# EAGLE design hoekdrive23 (EAGLE 5.12)
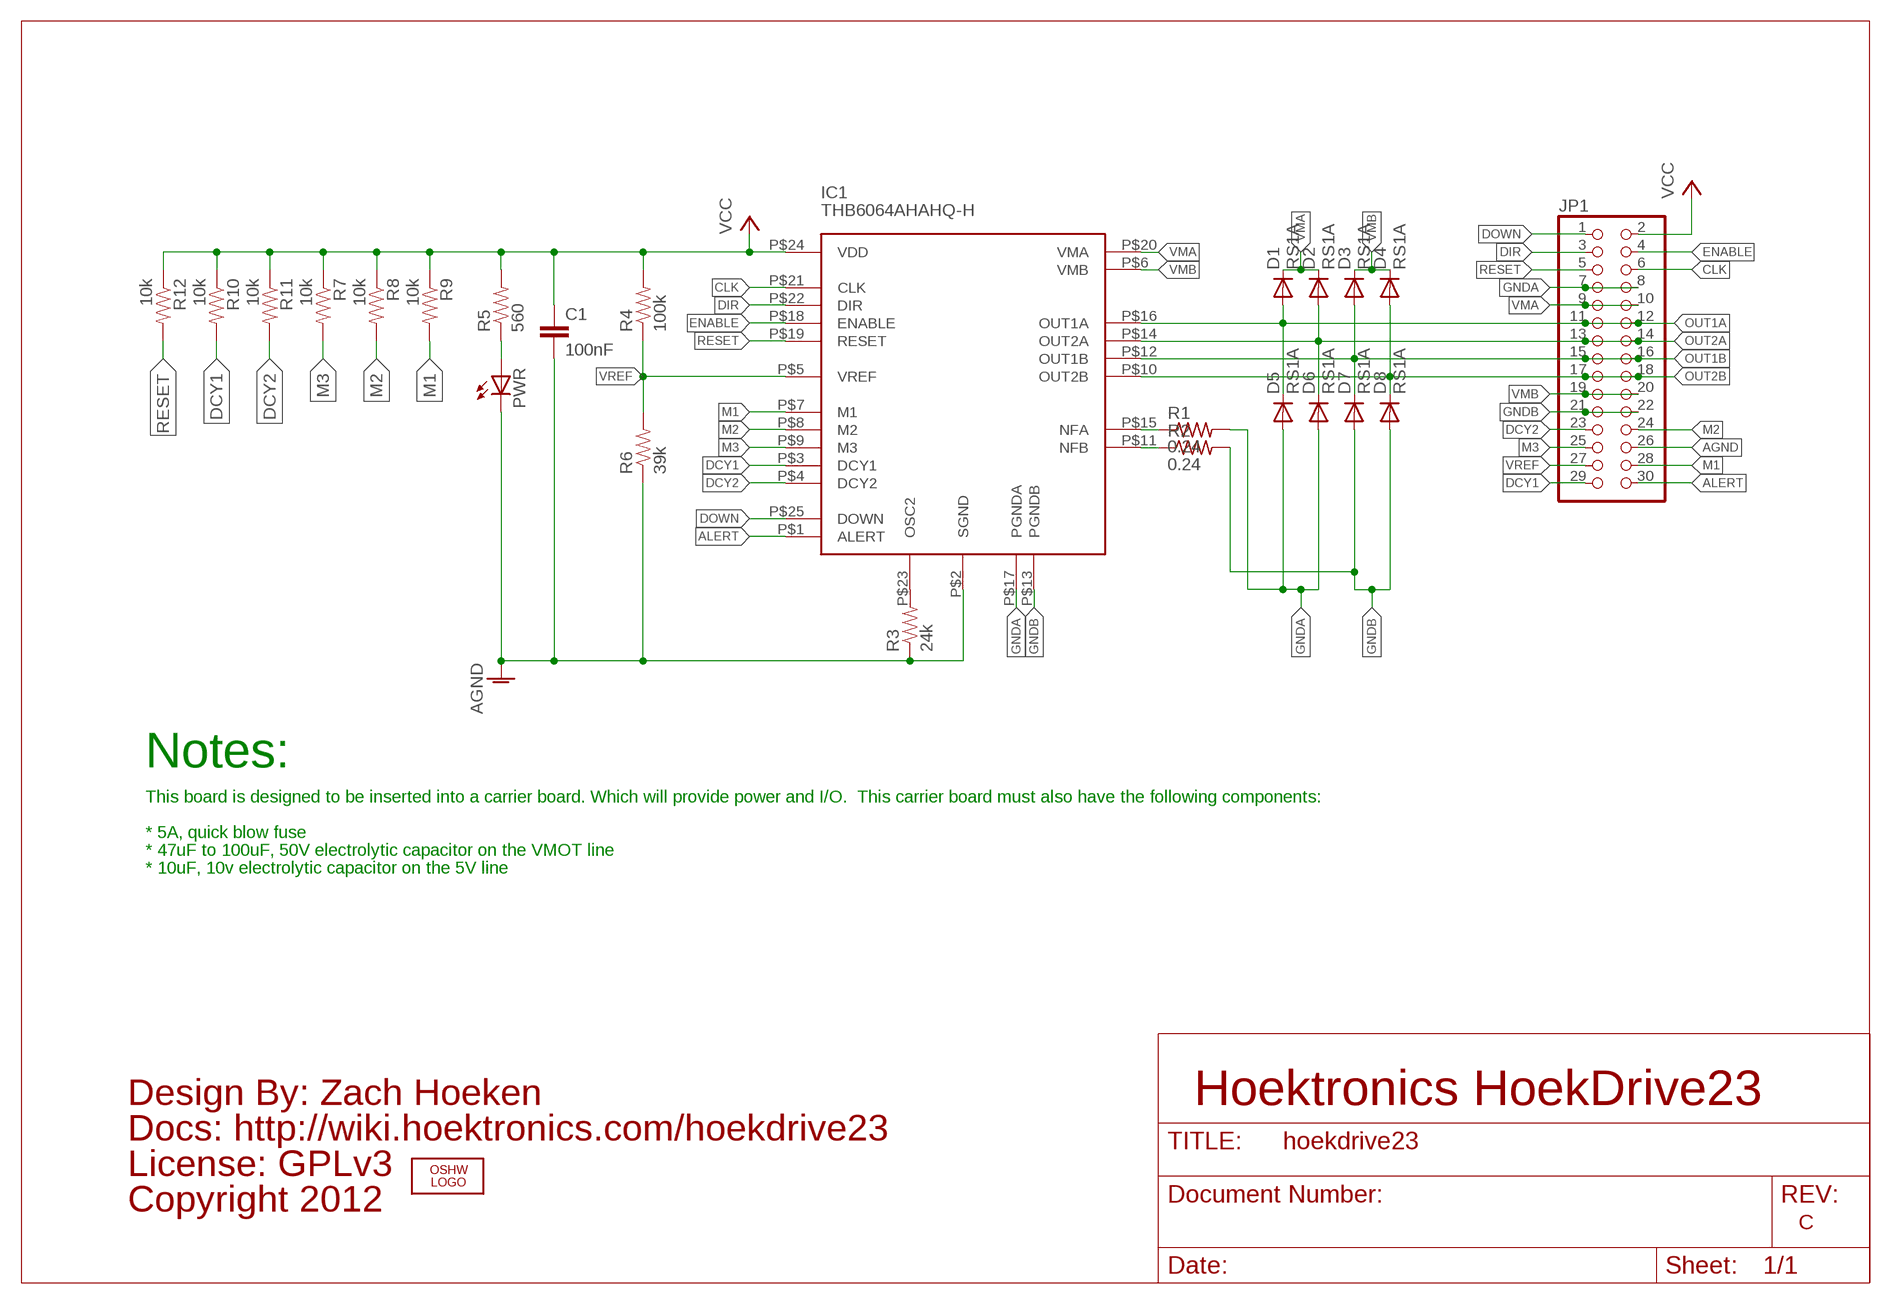
[diagram p0: schematic, sheet 1]

## Parts
C1  100nF  CAPACITOR0603  [0603-RC]
D1  RS1A  DIODESMA  [SMA-DIODE]
D2  RS1A  DIODESMA  [SMA-DIODE]
D3  RS1A  DIODESMA  [SMA-DIODE]
D4  RS1A  DIODESMA  [SMA-DIODE]
D5  RS1A  DIODESMA  [SMA-DIODE]
D6  RS1A  DIODESMA  [SMA-DIODE]
D7  RS1A  DIODESMA  [SMA-DIODE]
D8  RS1A  DIODESMA  [SMA-DIODE]
IC1  THB6064AHAHQ-H  [HZIP25H]
JP1  PINHD-2X15/90  [2X15/90]
LOGO1  OSHW_LOGO_10MILX0750-NT  [OSHW_10X750_NOTEXT]
PWR  LED0603  [0603-LED]
R1  0.24  R-US_R2512  [R2512]
R2  0.24  R-US_R2512  [R2512]
R3  24k  RESISTOR0603  [0603-RC]
R4  100k  RESISTOR0603  [0603-RC]
R5  560  RESISTOR0603  [0603-RC]
R6  39k  RESISTOR0603  [0603-RC]
R7  10k  RESISTOR0603  [0603-RC]
R8  10k  RESISTOR0603  [0603-RC]
R9  10k  RESISTOR0603  [0603-RC]
R10  10k  RESISTOR0603  [0603-RC]
R11  10k  RESISTOR0603  [0603-RC]
R12  10k  RESISTOR0603  [0603-RC]

## Nets
AGND: C1.2 IC1.P$2(SGND) JP1.26 PWR.C R3.1 R6.1
ALERT: IC1.P$1(ALERT) JP1.30
CLK: IC1.P$21(CLK) JP1.6
DCY1: IC1.P$3(DCY1) JP1.29 R10.2
DCY2: IC1.P$4(DCY2) JP1.23 R11.2
DIR: IC1.P$22(DIR) JP1.3
DOWN: IC1.P$25(DOWN) JP1.1
ENABLE: IC1.P$18(ENABLE) JP1.4
GNDA: D5.A D6.A IC1.P$17(PGNDA) JP1.7 JP1.8 R1.2
GNDB: D7.A D8.A IC1.P$13(PGNDB) JP1.21 JP1.22 R2.2
M1: IC1.P$7(M1) JP1.28 R9.2
M2: IC1.P$8(M2) JP1.24 R8.2
M3: IC1.P$9(M3) JP1.25 R7.2
N$2: IC1.P$11(NFB) R2.1
N$3: PWR.A R5.1
N$4: IC1.P$15(NFA) R1.1
OSC2: IC1.P$23(OSC2) R3.2
OUT1A: D1.A D5.C IC1.P$16(OUT1A) JP1.11 JP1.12
OUT1B: D3.A D7.C IC1.P$12(OUT1B) JP1.15 JP1.16
OUT2A: D2.A D6.C IC1.P$14(OUT2A) JP1.13 JP1.14
OUT2B: D4.A D8.C IC1.P$10(OUT2B) JP1.17 JP1.18
RESET: IC1.P$19(RESET) JP1.5 R12.2
VCC: C1.1 IC1.P$24(VDD) JP1.2 R4.2 R5.2 R7.1 R8.1 R9.1 R10.1 R11.1 R12.1
VMA: D1.C D2.C IC1.P$20(VMA) JP1.9 JP1.10
VMB [power]: D3.C D4.C IC1.P$6(VMB) JP1.19 JP1.20
VREF: IC1.P$5(VREF) JP1.27 R4.1 R6.2

## Notes on the sheet
- Notes:
- This board is designed to be inserted into a carrier board. Which will provide power and I/O.  This carrier board must also have the following components:
- * 5A, quick blow fuse
- * 47uF to 100uF, 50V electrolytic capacitor on the VMOT line
- * 10uF, 10v electrolytic capacitor on the 5V line
- Design By: Zach Hoeken | Hoektronics HoekDrive23
- Docs: http://wiki.hoektronics.com/hoekdrive23
- License: GPLv3
- Copyright 2012
- C

## Library data of the parts
C1 = Hoektronics:CAPACITOR: Capacitor Standard 0603 ceramic capacitor, and 0.1" leaded capacitor.
D1-D8 = SparkFun:DIODE: Diode These are standard reverse protection diodes and small signal diodes. SMA package can handle up to about 1A. SOD-323 can handle about 200mA. What the SOD-323 package when ordering, there are some mfgs out there that are 5-pin packages.
IC1 = Hoektronics:THB6064AH
JP1 = pinhead:PINHD-2X15: PIN HEADER
LOGO1 = ohw-logo:OSHW_LOGO_10MIL
PWR = Hoektronics:LED: LEDs Standard schematic elements and footprints for 5mm, 3mm, 1206, and 0603 sized LEDs. 5mm - Spark Fun Electronics SKU : COM-00529 (and others)
R1 R2 = rcl:R-US_: RESISTOR, American symbol
R3-R12 = Hoektronics:RESISTOR: Resistor Basic schematic elements and footprints for 0603, 1206, and PTH 1/10th watt (small) resistors.

## Net classes
1 power: width 1.27 mm, clearance 0.305 mm

## Board
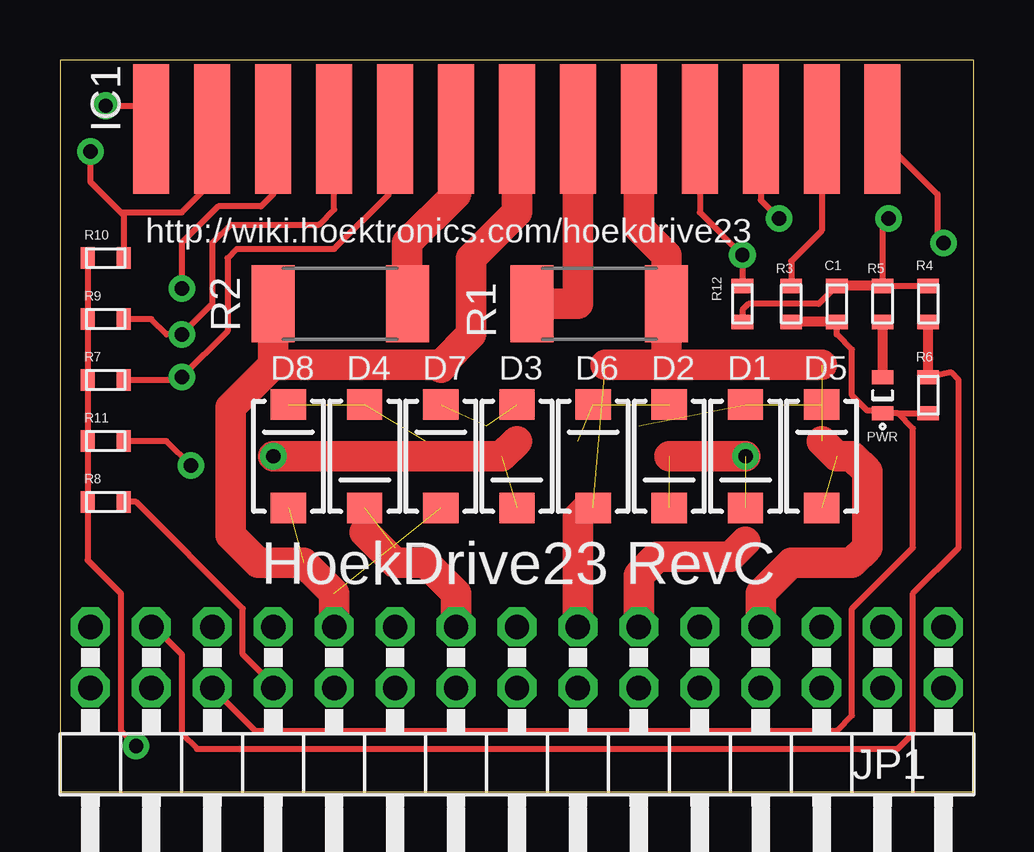
[diagram p1: board, top side]
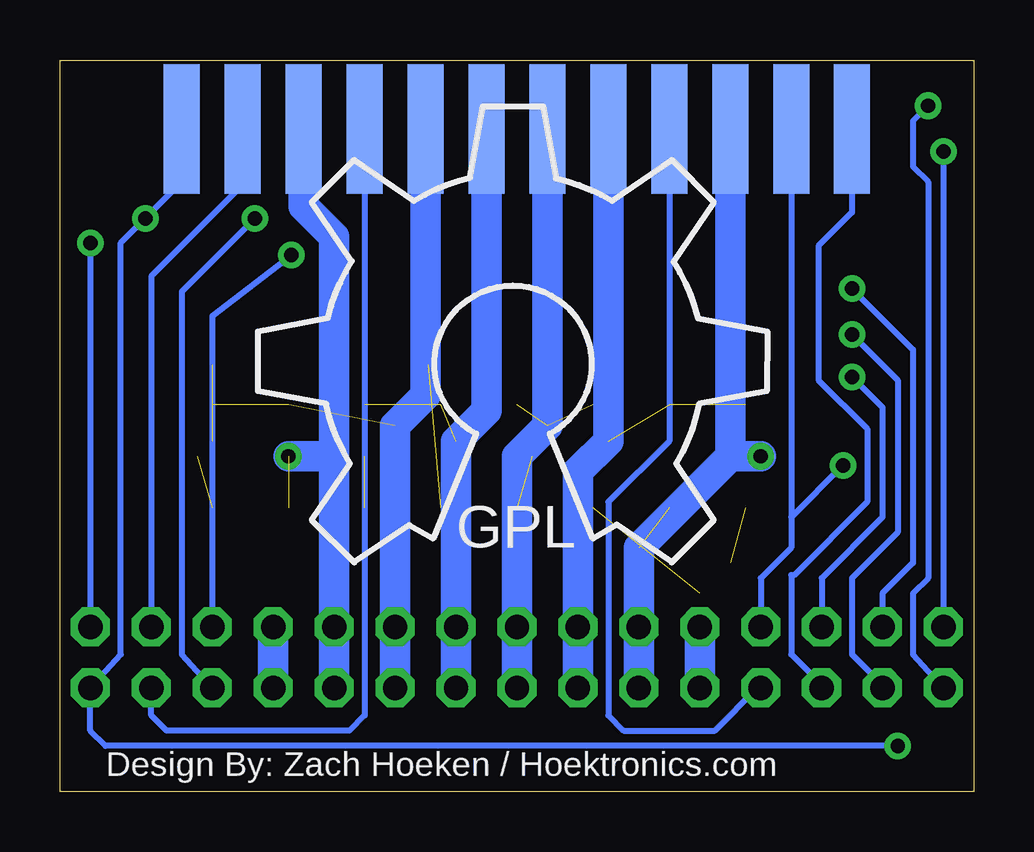
[diagram p2: board, bottom side, seen from below]

Size 38.1 x 30.48 mm. Coordinates in mm from the lower left corner, seen from the top.
Outline: 0,30.48 0,0 38.1,0 38.1,30.48 0,30.48
Copper layers (1*16): Top 0.035mm / dielectric 1.5mm / Bottom 0.035mm
Design rules "hoektronics": minimum track width 8mil, minimum drill 20mil, track to track 8mil, track to pad 8mil, pad to pad 8mil, via to via 8mil, smd to smd 8mil, copper to edge 10mil, drill to drill 8mil, minimum pad ring 12mil, minimum via ring 10mil, stop-mask expansion 4mil, vias tented up to drill 25mil, thermal gap 10mil

### Footprints (pad centres in the part's own frame; a part is rotated, then mirrored left to right if it is on the bottom)
0603-RC = smd 0.6 x 0.9: 1 -0.75,0; 2 0.75,0
SMA-DIODE = smd 1.27 x 1.47: A -2.15,0; C 2.15,0
HZIP25H = smd 1.5 x 5.4: P$1 -15.24,-11.25; P$3 -12.7,-11.25; P$5 -10.16,-11.25; P$7 -7.62,-11.25; P$9 -5.08,-11.25; P$11 -2.54,-11.25; P$13 0,-11.25; P$15 2.54,-11.25; P$17 5.08,-11.25; P$19 7.62,-11.25; P$21 10.16,-11.25; P$23 12.7,-11.25; P$25 15.24,-11.25 | smd 1.5 x 5.4 bottom: P$2 -13.97,-11.25; P$4 -11.43,-11.25; P$6 -8.89,-11.25; P$8 -6.35,-11.25; P$10 -3.81,-11.25; P$12 -1.27,-11.25; P$14 1.27,-11.25; P$16 3.81,-11.25; P$18 6.35,-11.25; P$20 8.89,-11.25; P$22 11.43,-11.25; P$24 13.97,-11.25
2X15/90 = drill 1.016 octagon: 1 -17.78,-6.35; 2 -17.78,-3.81; 3 -15.24,-6.35; 4 -15.24,-3.81; 5 -12.7,-6.35; 6 -12.7,-3.81; 7 -10.16,-6.35; 8 -10.16,-3.81; 9 -7.62,-6.35; 10 -7.62,-3.81; 11 -5.08,-6.35; 12 -5.08,-3.81; 13 -2.54,-6.35; 14 -2.54,-3.81; 15 0,-6.35; 16 0,-3.81; 17 2.54,-6.35; 18 2.54,-3.81; 19 5.08,-6.35; 20 5.08,-3.81; 21 7.62,-6.35; 22 7.62,-3.81; 23 10.16,-6.35; 24 10.16,-3.81; 25 12.7,-6.35; 26 12.7,-3.81; 27 15.24,-6.35; 28 15.24,-3.81; 29 17.78,-6.35; 30 17.78,-3.81
0603-LED = smd 0.6 x 0.9: A 0.75,0; C -0.75,0
R2512 = smd 1.8 x 3.2: 1 -2.8,0; 2 2.8,0

### Placement (x,y rotation side)
C1  32.38,20.32 270 top
D1  28.57,13.97 270 top
D2  25.4,13.97 270 top
D3  19.05,13.97 270 top
D4  12.7,13.97 270 top
D5  31.75,13.97 90 top
D6  22.23,13.97 90 top
D7  15.88,13.97 90 top
D8  9.53,13.97 90 top
IC1  19.05,38.86 0 top
JP1  19.05,0.51 180 top
LOGO1  29.84,9.53 0 bottom
PWR  34.29,16.51 90 top
R1  22.48,20.32 0 top
R2  11.68,20.32 180 top
R3  30.48,20.32 90 top
R4  36.2,20.32 90 top
R5  34.29,20.32 90 top
R6  36.2,16.51 90 top
R7  1.91,17.14 0 top
R8  1.91,12.06 0 top
R9  1.91,19.68 0 top
R10  1.91,22.23 0 top
R11  1.91,14.61 0 top
R12  28.45,20.32 90 top

### Tracks (layer width: path | path; a pad name or v marks a point on that pad's centre or on a via)
AGND
  Top 0.254: 34.92,15.76 PWR.C 34.17,15.88 33.66,15.88 33.02,16.51 33.02,18.41 32.38,19.05 C1.2 | 34.92,15.76 R6.1 | 34.92,15.76 35.56,15.12 35.56,10.16 33.02,7.62 33.02,3.17 32.38,2.54 8.13,2.54 JP1.26
  Top 0.406: C1.2 R3.1
  Bottom 0.254: IC1.P$2 5.08,24.13 6.48,22.73 6.48,17.14 4.45,15.11 4.45,12.06 7.49,9.02 7.62,9.02 7.62,5.71 6.35,4.45 JP1.26
ALERT  (via drill 0.6)
  Top 0.254: 3.81,27.94 IC1.P$1 3.81,28.57 v1.91,28.57
  Bottom 0.254: JP1.30 2.54,5.71 2.54,8.26 1.91,8.89 1.91,25.4 2.54,26.04 2.54,27.94 v1.91,28.57
CLK  (via drill 0.6)
  Top 0.254: IC1.P$21 29.21,24.64 v29.97,23.88
  Bottom 0.254: JP1.6 33.02,5.71 33.02,20.83 v29.97,23.88
DCY1  (via drill 0.6)
  Top 0.254: 6.35,26.67 6.35,25.4 5.08,24.13 2.54,24.13 | v1.27,26.67 1.27,25.4 2.54,24.13 | R10.2 2.65,24.02 2.54,24.13
  Top 0.406: 6.35,26.67 IC1.P$3
  Bottom 0.254: v1.27,26.67 JP1.29
DCY2  (via drill 0.6)
  Top 0.254: v5.46,13.59 4.45,14.61 R11.2
  Bottom 0.254: IC1.P$4 7.62,11.43 | JP1.23 8.89,8.89 7.62,10.16 7.62,11.43 | 7.62,11.43 v5.46,13.59
DIR
  Bottom 0.254: IC1.P$22 30.48,25.27 34.29,21.46 JP1.3
DOWN  (via drill 0.6)
  Top 0.254: IC1.P$25 34.29,27.18 36.58,24.89 36.58,23.11 v36.83,22.86
  Bottom 0.254: v36.83,22.86 JP1.1
ENABLE
  Bottom 0.254: IC1.P$18 25.4,3.17 26.04,2.54 33.66,2.54 34.29,3.17 JP1.4
GNDA  (3 unrouted)
  Top 1.27: 22.73,17.78 25.4,17.78 | 25.4,17.78 31.75,17.78 | 25.4,17.78 25.28,18.41 R1.2 25.28,22.35 24.13,23.5 IC1.P$17 | JP1.7 29.21,8.26 30.48,9.53 33.02,9.53 33.66,10.16 33.66,13.34 33.02,13.97 32.38,13.97 31.75,14.61
  Bottom 1.27: JP1.8 JP1.7
GNDB  (2 unrouted)
  Top 1.27: JP1.21 11.43,8.26 10.16,9.53 8.26,9.53 7.11,10.67 7.11,16 8.89,17.78 | 8.89,17.78 9.53,17.78 15.75,17.78 | 15.75,17.78 15.88,17.78 17.14,19.05 17.14,22.23 19.05,24.13 IC1.P$13 | R2.2 8.88,17.79 8.89,17.78 | 15.75,17.78 15.88,17.65
  Bottom 1.27: JP1.22 JP1.21
M1  (via drill 0.6)
  Top 0.254: 11.43,26.04 11.43,24.26 10.79,23.62 7.11,23.62 6.35,22.86 6.35,20.32 v5.08,19.05 4.45,19.05 3.81,19.68 R9.2
  Top 0.406: 11.43,26.04 IC1.P$7
  Bottom 0.254: v5.08,19.05 3.17,17.14 3.17,10.79 5.08,8.89 5.08,5.71 3.81,4.45 JP1.28
M2
  Top 0.254: JP1.24 8.89,4.45 7.62,5.71 7.62,7.62 3.17,12.06 R8.2
  Bottom 0.254: IC1.P$8 12.7,14.61 15.24,12.06 15.24,3.17 14.61,2.54 10.79,2.54 9.02,4.32 JP1.24
M3  (via drill 0.6)
  Top 0.254: IC1.P$9 13.72,27.44 13.72,24.89 11.43,22.61 7.37,22.61 6.99,22.23 6.99,19.18 v5.08,17.27 4.95,17.14 R7.2
  Top 0.406: IC1.P$9 13.97,26.04
  Bottom 0.254: JP1.25 6.35,8.89 3.81,11.43 3.81,16 v5.08,17.27
N$2
  Top 0.254: R2.1 14.48,21.33 14.48,21.34
  Top 1.27: IC1.P$11 16.51,24.89 14.48,22.86 14.48,21.34 14.48,20.19
N$3
  Top 0.406: R5.1 PWR.A
N$4
  Top 1.27: R1.1 21.59,20.32 IC1.P$15
OSC2
  Top 0.254: R3.2 30.48,22.1 31.75,23.37 IC1.P$23
OUT1A  (2 unrouted)
  Top 1.27: 28.57,10.41 27.94,9.78 24.89,9.78 24.13,9.02 JP1.11
  Bottom 1.27: IC1.P$16 22.86,16.51 24.13,15.24 JP1.11 JP1.12
OUT1B  (2 unrouted)
  Bottom 1.27: JP1.16 JP1.15 19.05,13.97 17.78,15.24 IC1.P$12
OUT2A  (2 unrouted)
  Top 1.27: 21.98,11.82 21.59,11.43 JP1.13
  Bottom 1.27: JP1.14 JP1.13 21.59,14.61 20.32,15.88 IC1.P$14
OUT2B  (2 unrouted)
  Top 1.27: 12.7,10.79 13.97,9.53 15.24,9.53 16.51,8.26 JP1.17
  Bottom 1.27: JP1.18 JP1.17 16.51,13.34 15.24,14.61 IC1.P$10
RESET  (via drill 0.6)
  Top 0.254: R12.2 v28.45,22.35 26.67,24.13 IC1.P$19
  Bottom 0.254: JP1.5 31.75,19.81 v28.45,22.35
VCC  (via drill 0.6)
  Top 0.254: v34.54,23.88 34.29,23.62 R5.2 R4.2 | v3.17,1.91 2.54,2.54 2.54,8.26 1.16,9.64 R8.1 R11.1 R7.1 R9.1 R10.1 | R12.1 28.45,20.07 28.7,20.32 31.64,20.32 C1.1
  Top 0.406: R5.2 C1.1
  Bottom 0.254: IC1.P$24 33.02,25.4 v34.54,23.88 35.56,22.86 35.56,5.71 JP1.2 36.83,2.54 36.2,1.91 v3.17,1.91
VMA  (via drill 0.6)  (2 unrouted)
  Top 1.27: v28.57,13.97 25.4,13.97
  Bottom 1.27: IC1.P$20 27.94,24.38 26.67,23.11 26.67,13.97 | 26.67,13.97 JP1.9 JP1.10 | 26.67,13.97 v28.57,13.97
VMB  (via drill 0.6)  (2 unrouted)
  Top 1.27: 19.05,14.61 18.41,13.97 12.7,13.97 v8.89,13.97
  Bottom 1.27: 10.16,13.97 IC1.P$6 | JP1.20 JP1.19 13.97,10.16 10.16,13.97 | 10.16,13.97 v8.89,13.97
VREF  (via drill 0.6)
  Top 0.254: IC1.P$5 8.89,24.89 8.38,24.38 6.6,24.38 5.08,22.86 v5.08,20.95 | R6.2 37.15,17.46 37.47,17.14 37.47,10.16 35.56,8.26 35.56,2.41 34.92,1.78 5.71,1.78 5.08,2.41 5.08,5.71 3.94,6.86 JP1.27
  Top 0.406: R6.2 R4.1
  Bottom 0.254: v5.08,20.95 2.54,18.41 2.54,9.53 3.81,8.26 JP1.27

### Text on the board
tPlace: http://wiki.hoektronics.com/hoekdrive23 | HoekDrive23 RevC
bPlace: GPL | Design By: Zach Hoeken / Hoektronics.com